# Altium schematic sheet 04_ZYNQ_Power.SchDoc
size A3; SheetNumber: 4; SheetTotal: 9
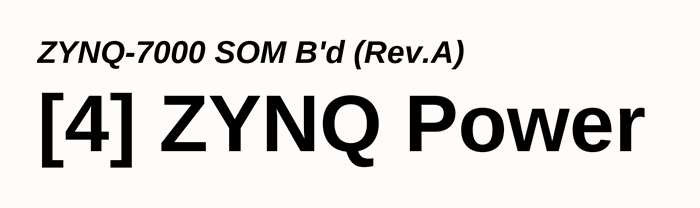
[diagram p0: 04_ZYNQ_Power.SchDoc]

## Notes on the sheet
- ZYNQ-7000 SOM B'd (Rev.A)
- [4] ZYNQ Power
- Title
- Rev
- Doc
- Sheet #
- of
- Author
- This document is copyright of ArkX and shall not be revealed, produced, copied, in whole or in part,
- Date
- nor used for any purpose other than submitted.